# Altium project Final_Project.PrjPcb
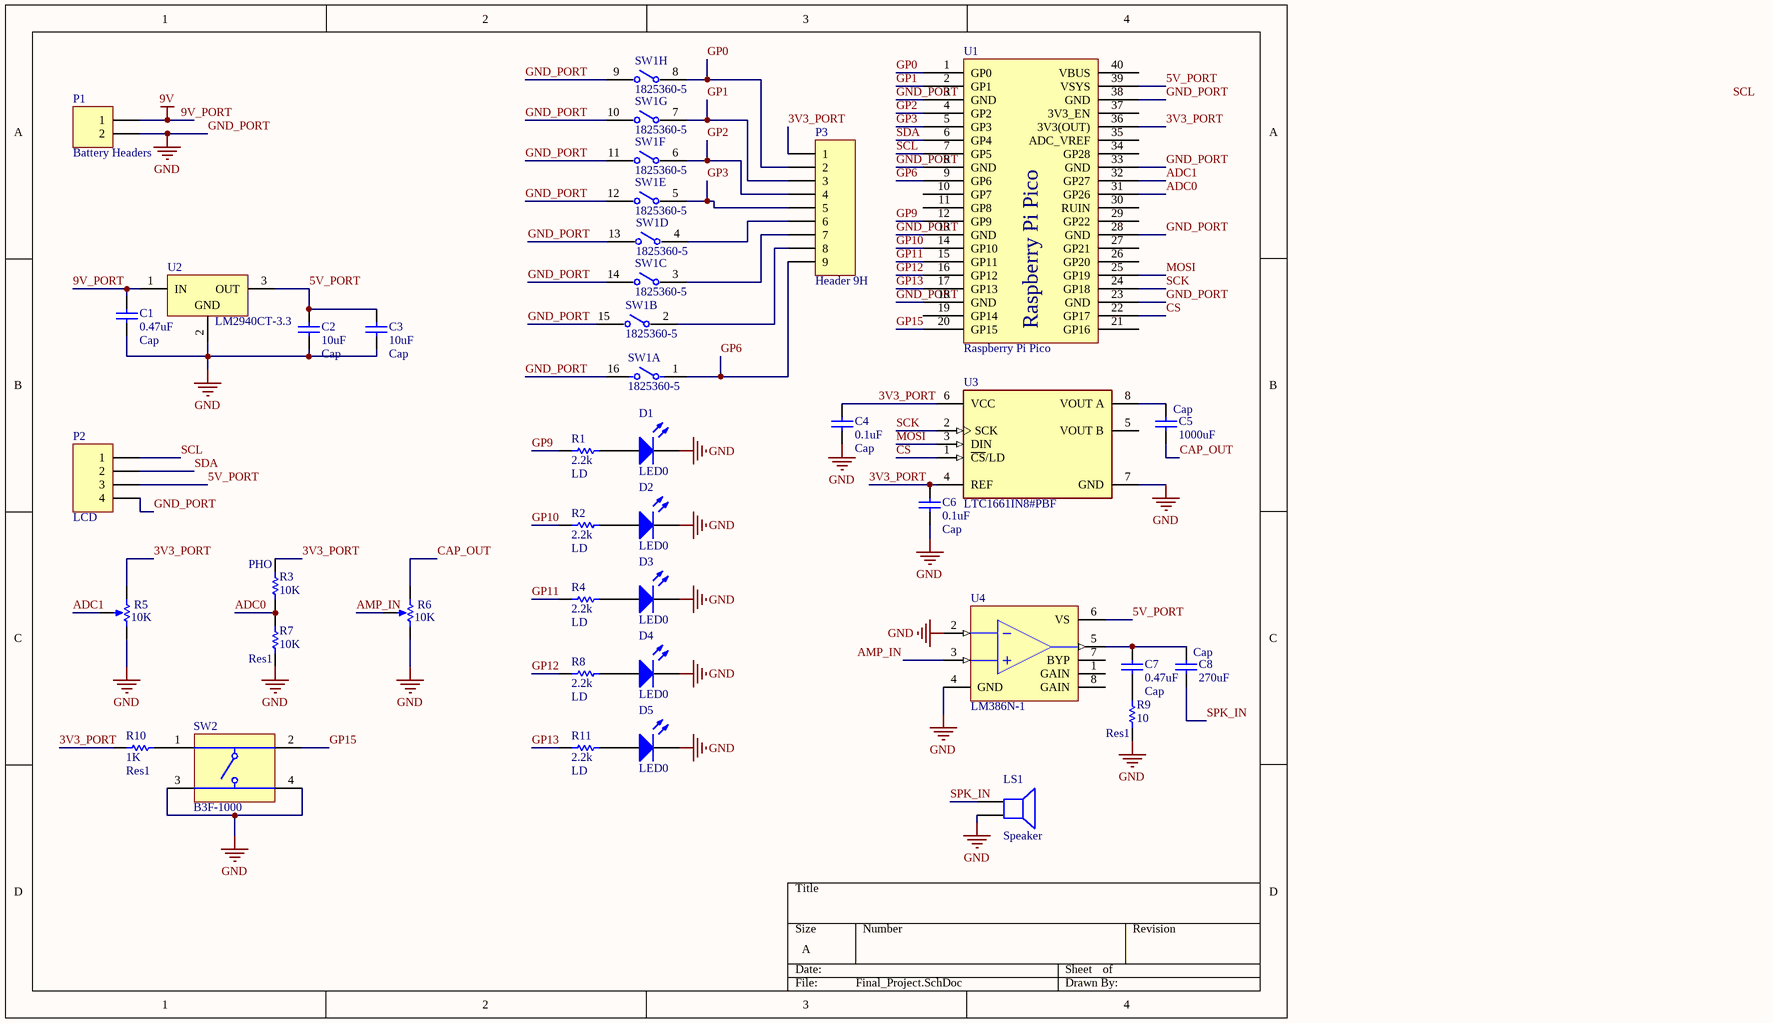
[diagram p0: Final_Project.SchDoc]
1 sheet, 34 parts. Net scope: global (net labels, ports and power ports of the same name join across sheets).
Board file: Final_Project.PcbDoc

## Sheet Final_Project.SchDoc
size A; SheetNumber: 1; SheetTotal: 1; SPICEModelCacheOFQIFQHK: <root> / <DocumentId>OFQIFQHK</DocumentId> / <CacheFrame Number="0"> / <Model Name="led0" Kind="MDL"> / <Text>*Typ INFRARED GaAs LED: Vf=1.2V Vr=5V If=40mA trr=3uS / *LED Pinout: 1=A, 2=K / .MODEL LED0 D (IS=93.5P RS=84M N=2.63 BV=5 IBV=10U / + CJO=2.97P VJ=.75 M=.333 TT=4.32U)</Text> / </Model> / </CacheFrame> / </root>

### Parts
C1  Cap  value 0.47uF  [RAD-0.3]
C2  Cap  value 10uF  [RAD-0.3]
C3  Cap  value 10uF  [RAD-0.3]
C4  Cap  value 0.1uF  [RAD-0.3]
C5  Cap  value 1000uF  [RAD-0.3]
C6  Cap  value 0.1uF  [RAD-0.3]
C7  Cap  value 0.47uF  [RAD-0.3]
C8  Cap  value 270uF  [RAD-0.3]
D1  LED0  [LED-0]
D2  LED0  [LED-0]
D3  LED0  [LED-0]
D4  LED0  [LED-0]
D5  LED0  [LED-0]
LS1  Speaker  [PIN2]
P1  Battery Headers  [HDR1X2]
P2  LCD  [HDR1X4]
P3  Header 9H  [HDR1X9H]
R1  LD  value 2.2k  [AXIAL-0.3]
R2  LD  value 2.2k  [AXIAL-0.3]
R3  PHO  value 10K  [AXIAL-0.3]
R4  LD  value 2.2k  [AXIAL-0.3]
R5  value 10K  [POT inline wide]  (hidden comment: RPot_1)
R6  value 10K  [POT inline wide]  (hidden comment: RPot_1)
R7  Res1  value 10K  [AXIAL-0.3]
R8  LD  value 2.2k  [AXIAL-0.3]
R9  Res1  value 10  [AXIAL-0.3]
R10  Res1  value 1K  [AXIAL-0.3]
R11  LD  value 2.2k  [AXIAL-0.3]
SW1  1825360-5  [FP-1825360-5-MFG]  (parts A,B,C,D,E,F,G,H of 8)
SW2  B3F-1000  [OMRON-B3F-1000-4_V]
U1  Raspberry Pi Pico  [Raspberry Pi Pico]
U2  LM2940CT-3.3  [T03B]
U3  LTC1661IN8#PBF  [FP-N-8-05-08-1510-MFG]
U4  LM386N-1  [DIP-8]

### Nets
9V_PORT: C1.2 P1.1 U2.1(IN)  [also labelled 9V]
GND_PORT: C1.1 C2.1 C3.1 C4.1 C6.1 D1.2(K) D2.2(K) D3.2(K) D4.2(K) D5.2(K) LS1.2 P1.2 P2.4 R5.3(BOT) R6.3(BOT) R7.1 R9.1 SW1.9 SW1.10 SW1.11 SW1.12 SW1.13 SW1.14 SW1.15 SW1.16 SW2.3 SW2.4 U1.3(GND) U1.8(GND) U1.13(GND) U1.18(GND) U1.23(GND) U1.28(GND) U1.33(GND) U1.38(GND) U2.2(GND) U3.7(GND) U4.2(IN-) U4.4(GND)  [also labelled GND]
3V3_PORT: C4.2 C6.2 P3.1 R3.2 R5.1(TOP) R10.1 U1.36(3V3(OUT)) U3.4(REF) U3.6(VCC)
5V_PORT: C2.2 C3.2 P2.3 U1.39(VSYS) U2.3(OUT) U4.6(VS)
ADC0: R3.1 R7.2 U1.31(GP26)
ADC1: R5.2(TAP) U1.32(GP27)
AMP_IN: R6.2(TAP) U4.3(IN+)
CAP_OUT: C5.1 R6.1(TOP)
CS: U1.22(GP17) U3.1(~{CS}/LD)
GP0: P3.2 SW1.8 U1.1(GP0)
GP1: P3.3 SW1.7 U1.2(GP1)
GP2: P3.4 SW1.6 U1.4(GP2)
GP3: P3.5 SW1.5 U1.5(GP3)
GP6: P3.9 SW1.1 U1.9(GP6)
GP9: R1.2 U1.12(GP9)
GP10: R2.2 U1.14(GP10)
GP11: R4.2 U1.15(GP11)
GP12: R8.2 U1.16(GP12)
GP13: R11.2 U1.17(GP13)
GP15: SW2.2 U1.20(GP15)
MOSI: U1.25(GP19) U3.3(DIN)
SCK: U1.24(GP18) U3.2(SCK)
SCL: P2.1 U1.7(GP5)
SDA: P2.2 U1.6(GP4)
SPK_IN: C8.1 LS1.1
NetC5_2: C5.2 U3.8(VOUT_A)
NetC7_1: C7.1 R9.2
NetC7_2: C7.2 C8.2 U4.5(OUT)
NetD1_1: D1.1(A) R1.1
NetD2_1: D2.1(A) R2.1
NetD3_1: D3.1(A) R4.1
NetD4_1: D4.1(A) R8.1
NetD5_1: D5.1(A) R11.1
NetP3_6: P3.6 SW1.4
NetP3_7: P3.7 SW1.3
NetP3_8: P3.8 SW1.2
NetR10_2: R10.2 SW2.1

Not connected (* = marked no-connect by the designer): U1 10(GP7) 11(GP8) 19(GP14) 21(GP16) 26(GP20) 27(GP21) 29(GP22) 30(RUIN) 34(GP28) 35(ADC_VREF) 37(3V3_EN) 40(VBUS); U3 5(VOUT_B); U4 1(GAIN) 7(BYP) 8(GAIN)

### Notes on the sheet
- Labels drawn without touching a wire or pin: SCL

### Library data of the parts
C1-C8 = Cap: Capacitor; Published: 8-Jun-2000; LatestRevisionDate: 17-Jul-2002; LatestRevisionNote: Re-released for DXP Platform.; PackageReference: RAD-0.3; Publisher: Altium Limited; PackageDescription: Radial Cap, Thru-Hole; 2 Leads; 0.3 in Pin Spacing
D1-D5 = LED0: Typical INFRARED GaAs LED; Published: 8-Jun-2000; LatestRevisionDate: 08-Jul-2005; LatestRevisionNote: Mech Layer 1 removed.; PackageReference: LED-0; Publisher: Altium Limited; PackageDescription: LED; 2 Leads
LS1 = Speaker: Loudspeaker; Published: 24-Mar-1999; LatestRevisionDate: 17-Jul-2002; LatestRevisionNote: Re-released for DXP Platform.; PackageReference: PIN2; Publisher: Altium Limited
P1 = Header 2: Header, 2-Pin; LatestRevisionDate: 17-Jul-2002; LatestRevisionNote: Re-released for DXP Platform.; Publisher: Altium Limited
P2 = Header 4: Header, 4-Pin; LatestRevisionDate: 17-Jul-2002; LatestRevisionNote: Re-released for DXP Platform.; Publisher: Altium Limited
P3 = Header 9H: Header, 9-Pin, Right Angle; LatestRevisionDate: 17-Jul-2002; LatestRevisionNote: Re-released for DXP Platform.; Publisher: Altium Limited
R1-R4 R7-R11 = Res1: Resistor; Published: 8-Jun-2000; LatestRevisionDate: 17-Jul-2002; LatestRevisionNote: Re-released for DXP Platform.; PackageReference: AXIAL-0.3; Publisher: Altium Limited; PackageDescription: Axial Device, Thru-Hole; 2 Leads; 0.3 in Pin Spacing
R5 R6 = RPot_3: Potentiometer; Sim Note: Enter the Resistance value and the set point into parameter fields.; Set Position: 0.5; Published: 8-Jun-2000; LatestRevisionDate: 17-Jul-2002; LatestRevisionNote: Re-released for DXP Platform.; PackageReference: VR5; Publisher: Altium Limited; PackageDescription: Variable Resistor, Thru-Hole; 3 Leads
SW1 = CMP-03400-000027-1: SWITCH SLIDE DIP SPST 100MA 24V; Contact Current Rating: 1A; Actuator Length: 0.99mm; Contact Resistance: 50mR; Voltage Rating (DC): 5V; Body Material: Polyphenylene; Pitch: 0.1inch; Washable: Yes; Actuator Type: Slide (Standard); Number of Positions: 8; Mechanical Life: 1000Cycles; Contact Post Length: 4mm; Sealable: No (Without); Actuator Material: Polybutylene; RoHS Compliant: Yes; Throw Configuration: SPST; Packaging: Rail/Tube; Orientation: Straight; Terminal Pitch: 2.54mm; Contact Plating: Gold; Height: 0.138inch; ELV: Compliant; Housing Material: Polyphenylene; Max Operating Temperature: 85°C; Length: 0.876inch; Flammability Rating: UL94 V-0; Housing Color: Black; Type: Switch; Contact Material: Copper Alloy; Package Quantity: 20; Series: ADE; Max Voltage Rating (DC): 24V; Termination: PC Pins; Number of Circuits: 8; Max Current Rating: 100mA; Radiation Hardening: No; Min Operating Temperature: -30°C; Mount: Through Hole; Electrical Life: 1000Cycles
SW2 = CMP-1677-00002-1: Tactile Switch, SPST-NO, 0.05 A, 5 to 24 V, -25 to 70 degC, 4-Pin THD, RoHS, Bulk; Shielding: Shielded; Gender: Female; Capacitance: -45 f; Voltage Rating: 150 V; Current Rating: 1.5 A; Radiation Hardening: No; Contact Plating: Gold; Height: 14.99 mm; Min Operating Temperature: -40 degC; Packaging: Tray; ComponentLink2Description: Datasheet; ComponentLink1URL: http://www.omron.com/; Lead Pitch: 1.27 mm; RoHSCompliant: true; Pins: 8; PackageReference: B3F-1000; Width: 25.4 mm; Contact Material: Brass; ComponentLink2URL: http://www.omron.com/ecb/products/pdf/en-b3f.pdf; PackageDescription: 4-Pin Through Hole Device, Body 6 x 6 mm; DatasheetVersion: Jan-15; ComponentLink1Description: Manufacturer URL; Package Quantity: 1080; Mount: Through Hole; Length: 18.34 mm; Max Operating Temperature: 70 degC
U2 = LM2940CT-5.0: 1A Low Dropout Regulator, 3-pin TO-220; Manufacturer: National Semiconductor; PackageTopMarking: NSUZXYTTE#*LM2940CT*-5.0 P+; PowerWise: N; CompType: LDO IC; High-Reliability: Y; DatasheetVersion: Jan-2007; PackageVersion: revL, Jan-1992; PackageReference: T03B; PackageDescription: TO-220, Molded, 3 Lead, Straight; PartNumber: LM2940CT-3.3; RoHS: N; PinCount: 3; ComponentLink1Description: Manufacturer URL; ComponentLink1URL: http://www.national.com/; ComponentLink2Description: LM2940C Datasheet; ComponentLink2URL: http://www.national.com/ds/LM/LM2940C.pdf; ComponentLink3Description: LM2940C Web Page; ComponentLink3URL: http://www.national.com/pf/LM/LM2940C.html; ComponentLink4Description: T03B Package Page; ComponentLink4URL: http://www.national.com/packaging/folders/t03b.html
U3 = CMP-00026-88317689-1: LTC1661IN8#PBF Dual Serial Input Loading 30 Us Settling Time 10-BIT Dac PDIP8; Manufacturer Lifecycle Status: PRODUCTION; Min Supply Voltage: 2.7V; Resolution: 1.25B; Number of Bits: 10; Output Type: Voltage; Max Supply Voltage: 5.5V; Integral Nonlinearity (INL): 2LSB; Supply Type: Single; Settling Time: 30µs; Number of Converters: 2; Case/Package: DIP; Lifecycle Status: Production; NexarPartId: 88317689; Number of Pins: 8; RoHS: Compliant; Min Operating Temperature: -40°C; Max Operating Temperature: 85°C; Interface: Serial; Lead Free: Lead Free; Mount: Through Hole; Number of Channels: 2
U4 = LM386N-1: Low-Voltage Audio Power Amplifier; Published: 15-Apr-2002; DatasheetDocument: Sep-1997; PackageDocument: Sep-1997; PackageReference: N08E; Publisher: Altium Limited